# EAGLE design dw-probe-v2.0 (EAGLE 9.5.1)
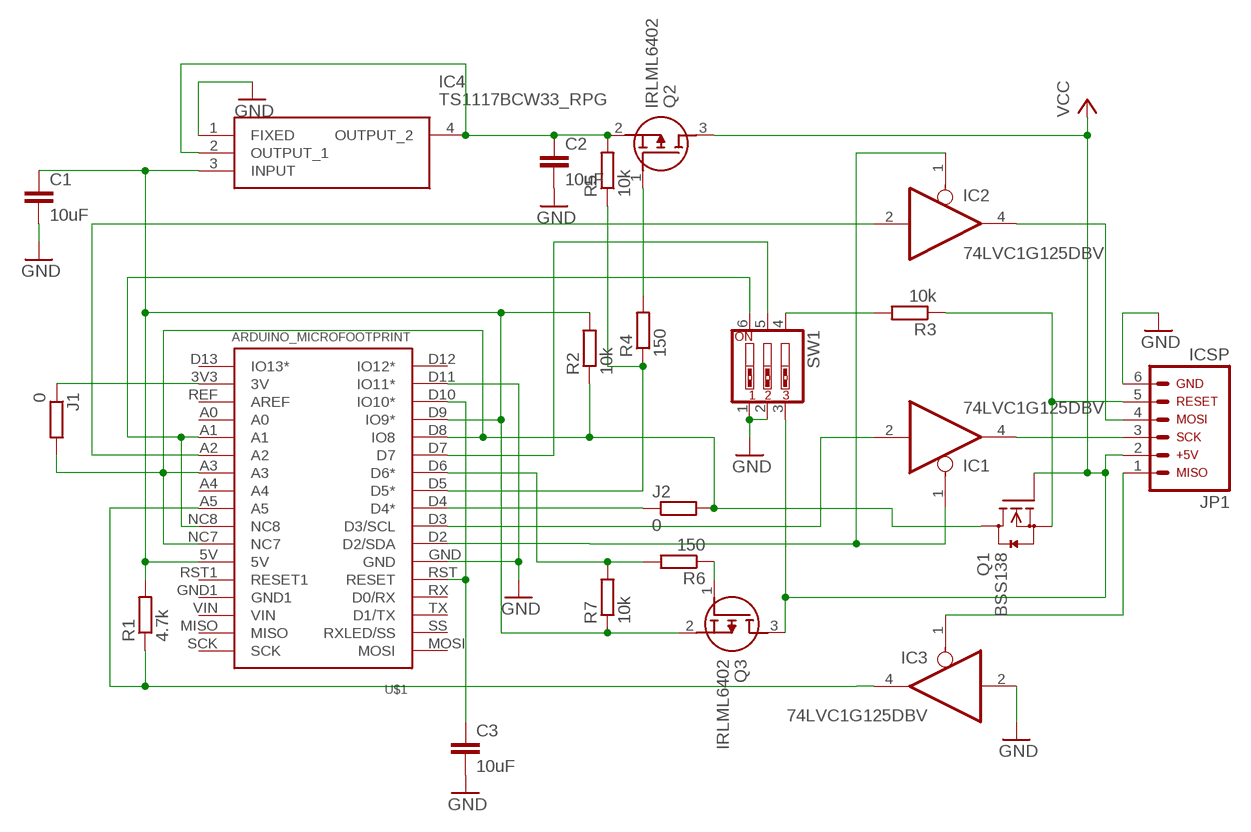
[diagram p0: schematic, sheet 1]

## Parts
C1  10uF  C-EUC0805  [C0805]
C2  10uF  C-EUC0805  [C0805]
C3  10uF  C-EUC0805  [C0805]
IC1  74LVC1G125DBV  [SOT23-5]
IC2  74LVC1G125DBV  [SOT23-5]
IC3  74LVC1G125DBV  [SOT23-5]
IC4  TS1117BCW33_RPG  [SOT230P700X190-4N]
J1  0  R-EU_R0805  [R0805]
J2  0  R-EU_R0805  [R0805]
JP1  ARDUINO_CONN-ICSP  [CONN-2X03]
Q1  BSS138  [SOT23]
Q2  IRLML6402  [SOT95P237X112-3N]
Q3  IRLML6402  [SOT95P237X112-3N]
R1  4.7k  R-EU_R0805  [R0805]
R2  10k  R-EU_R0805  [R0805]
R3  10k  R-EU_R0805  [R0805]
R4  150  R-EU_R0805  [R0805]
R5  10k  R-EU_R0805  [R0805]
R6  150  R-EU_R0805  [R0805]
R7  10k  R-EU_R0805  [R0805]
SW1  SW_DIP-3  [EDG-03]
U$1  ARDUINO_MICROFOOTPRINT  [ARDUINO-MICRO]

## Nets
GND: C1.2 C2.2 C3.2 IC3.2(I) IC4.1(FIXED) JP1.6 SW1.1 SW1.2 U$1.D11(IO11*) U$1.GND
N$1: R3.2 SW1.4
N$2: SW1.6 U$1.A1 U$1.NC8
N$3: IC1.1(OE) IC2.1(OE) U$1.D2(D2/SDA)
N$4: J1.2 J2.2 Q1.3(D) R2.1 U$1.A3 U$1.D8(IO8) U$1.NC7
N$5: C1.1 IC4.3(INPUT) Q3.2(S) R1.2 R2.2 R7.1 U$1.5V U$1.D9(IO9*)
N$6: IC1.2(I) U$1.D3(D3/SCL)
N$7: IC2.2(I) U$1.A2
N$8: IC3.4(O) R1.1 U$1.A5
N$9: C3.1 U$1.D10(IO10*) U$1.RST(RESET)
N$10: IC2.4(O) JP1.4
N$11: SW1.5 U$1.D7
N$12: IC3.1(OE) JP1.1
N$13: J1.1 U$1.3V3(3V)
N$14: JP1.5 Q1.2(S) R3.1
N$15: Q3.1(G) R6.1
N$16: C2.1 IC4.2(OUTPUT_1) IC4.4(OUTPUT_2) Q2.2(S) R5.2
N$17: IC1.4(O) JP1.3
N$18: R4.1 R5.1 U$1.D5(D5*)
N$19: Q2.1(G) R4.2
N$20: R6.2 R7.2 U$1.D6(D6*)
N$23: J2.1 U$1.D4(D4*)
VCC: JP1.2 Q1.1(G) Q2.3(D) Q3.3(D) SW1.3
Unconnected: U$1.A0 U$1.A4 U$1.D12(IO12*) U$1.D13(IO13*) U$1.GND1 U$1.MISO U$1.MOSI U$1.REF(AREF) U$1.RST1(RESET1) U$1.RX(D0/RX) U$1.SCK U$1.SS(RXLED/SS) U$1.TX(D1/TX) U$1.VIN

## Power pins joined to a net without a drawn wire
GND: IC1.3(GND) IC2.3(GND) IC3.3(GND)
VCC: IC1.5(VCC) IC2.5(VCC) IC3.5(VCC)

## Library data of the parts
C1-C3 = rcl:C-EU: CAPACITOR, European symbol; SPICEPREFIX: C
IC1-IC3 = 74xx-little-us:74*1G125: Single Bus Buffer Gate with 3-State Output
IC4 = TS1117BCW33_RPG:TS1117BCW33_RPG: Taiwan Semiconductor TS1117BCW33 RPG, LDO Regulator, 800mA, 3.3 V, +/-2% 4-Pin, SOT-223 Source: Datasheet <http://uk.rs-online.com/web/p/products/1698939>; ARROW_PART_NUMBER: TS1117BCW33 RPG; ARROW_PRICE-STOCK: https://www.arrow.com/en/products/ts1117bcw33rpg/taiwan-semiconductor; DESCRIPTION: Taiwan Semiconductor TS1117BCW33 RPG, LDO Regulator, 800mA, 3.3 V, +/-2% 4-Pin, SOT-223; HEIGHT: 1.9mm; MANUFACTURER_NAME: Taiwan Semiconductor; MANUFACTURER_PART_NUMBER: TS1117BCW33 RPG; MOUSER_PART_NUMBER: 821-TS1117BCW33RPG; MOUSER_PRICE-STOCK: https://www.mouser.co.uk/ProductDetail/Taiwan-Semiconductor/TS1117BCW33-RPG?qs=5aG0NVq1C4zdwcJSPRwZGg%3D%3D
J1 J2 R1-R7 = rcl:R-EU_: RESISTOR, European symbol; SPICEPREFIX: R
JP1 = arduino_jw:ARDUINO_CONN-ICSP: Arduino ICSP I/O Header This is the ICSP I/O header on the Arduino Uno R3. This connector is labeled with the following pin assignments: MISO +5V SCK MOSI RESET GND NOTE: Be sure you install this connector with the correct orientation on your PCB layout. Pin 1 has a square pad to assist with orientation.
Q1 = m-pad-2.1:BSS138: Fairchild Semiconductors BSS138 N-Channel Logic Level Enhancement Mode Field Effect Transistor General Description: These N-Channel enhancement mode field effect transistors are produced using Fairchild's proprietary, high cell density, DMOS technology. These products have been designed to minimize on-state resistance while provide rugged, reliable, and fast switching performance.These products are particularly suited for low voltage, low current applications such as small servo motor control, power MOSFET gate drivers, and other switching applications. Features: 0.22 A, 50 V. RDS(ON) = 3.5Ohm @ VGS = 10 V RDS(ON) = 6.0Ohm @ VGS = 4.5 V High density cell design for extremely low RDS(ON) Rugged and Reliable Compact industry standard SOT-23 surface mount package Please send any comments to: messi@users.sourceforge.net
Q2 Q3 = IRLML6402:IRLML6402: P-Channel MOSFET Transistor, 3.7 A, 20 V, 3-Pin SOT-23 International Rectifier IRLML6402 Source: Datasheet <https://datasheetspdf.com/pdf/513015/InternationalRectifier/IRLML6402/1>; DESCRIPTION: P-Channel MOSFET Transistor, 3.7 A, 20 V, 3-Pin SOT-23 International Rectifier IRLML6402; HEIGHT: 1.12mm; MANUFACTURER_NAME: Infineon; MANUFACTURER_PART_NUMBER: IRLML6402; MOUSER_PART_NUMBER: N/A; MOUSER_PRICE-STOCK: https://www.mouser.co.uk/ProductDetail/Infineon-IR/IRLML6402/?qs=Gkr2N%2F2q3o277qI%252BRzUP%252Bw%3D%3D
SW1 = special:SW_DIP-3: DIP SWITCH
U$1 = arduino-micro:ARDUINO_MICRO

## Board
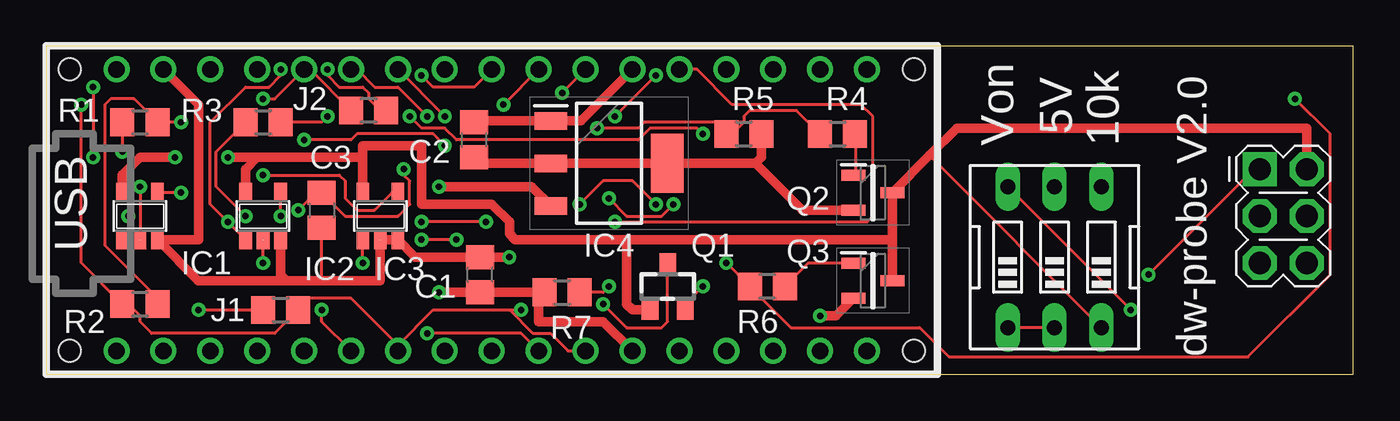
[diagram p1: board, top side]
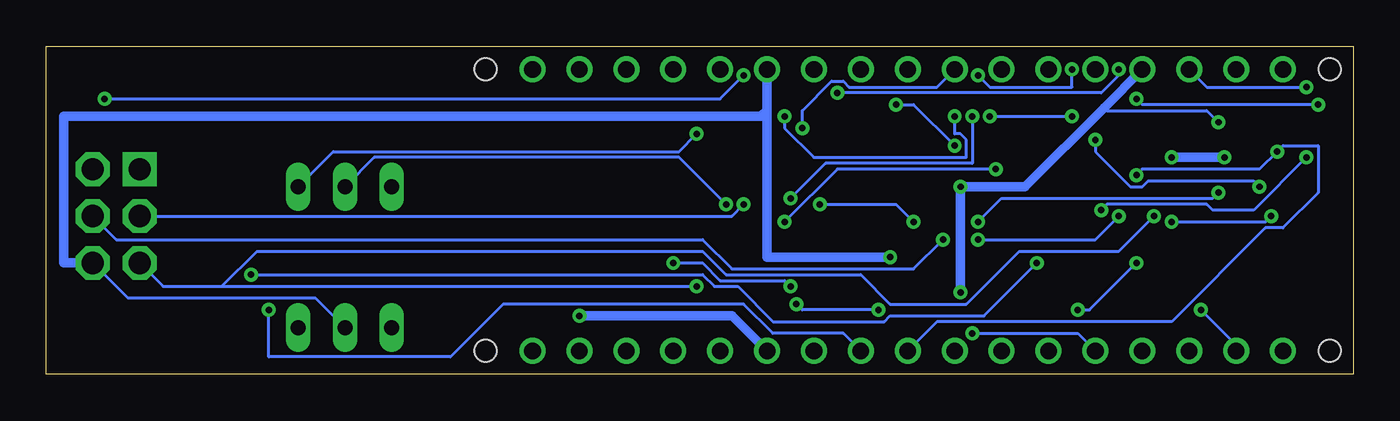
[diagram p2: board, bottom side, seen from below]

Size 70.79 x 17.77 mm. Coordinates in mm from the lower left corner, seen from the top.
Outline: 0,0 70.79,0 70.79,17.77 0,17.77 0,0
Copper layers (1*16): Top 0.035mm / dielectric 1.5mm / Bottom 0.035mm
Design rules "default *": minimum track width 6mil, minimum drill 0.35mm, track to track 6mil, track to pad 6mil, pad to pad 6mil, via to via 6mil, smd to smd 6mil, copper to edge 10mil, drill to drill 6mil, minimum pad ring 10mil, minimum via ring 8mil, stop-mask expansion 4mil, vias tented up to drill 0mil, thermal gap 10mil

### Footprints (pad centres in the part's own frame; a part is rotated, then mirrored left to right if it is on the bottom)
C0805 = smd 1.3 x 1.5: 1 -0.95,0; 2 0.95,0
SOT23-5 = smd 0.69 x 0.99: 1 -0.95,-1.29; 2 0,-1.29; 3 0.95,-1.29; 4 0.95,1.3; 5 -0.95,1.3
SOT230P700X190-4N = smd 1.75 x 0.95: 1 -3.15,2.3; 2 -3.15,0; 3 -3.15,-2.3 | smd 1.75 x 3.2: 4 3.15,0
R0805 = smd 1.3 x 1.5: 1 -0.95,0; 2 0.95,0
CONN-2X03 = drill 1.2 pad 1.829 square: 1 0,0 | drill 1.2 pad 1.829 octagon: 2 2.54,0; 3 0,-2.54; 4 2.54,-2.54; 5 0,-5.08; 6 2.54,-5.08
SOT23 = smd 0.9 x 1.2: 1 -0.95,-1.2; 2 0.95,-1.2; 3 0,1.2
SOT95P237X112-3N = smd 1.3 x 0.6: 1 -1.05,0.95; 2 -1.05,-0.95; 3 1.05,0
EDG-03 = drill 0.813 long: 1 -2.54,-3.81; 2 0,-3.81; 3 2.54,-3.81; 4 2.54,3.81; 5 0,3.81; 6 -2.54,3.81
ARDUINO-MICRO = drill 0.9: 3V3 16.51,3.81; 5V 16.51,29.21; A0 16.51,8.89; A1 16.51,11.43; A2 16.51,13.97; A3 16.51,16.51; A4 16.51,19.05; A5 16.51,21.59; D2 1.27,26.67; D3 1.27,24.13; D4 1.27,21.59; D5 1.27,19.05; D6 1.27,16.51; D7 1.27,13.97; D8 1.27,11.43; D9 1.27,8.89; D10 1.27,6.35; D11 1.27,3.81; D12 1.27,1.27; D13 16.51,1.27; GND 1.27,29.21; GND1 16.51,34.29; MISO 16.51,39.37; MOSI 1.27,41.91; NC7 16.51,26.67; NC8 16.51,24.13; REF 16.51,6.35; RST 1.27,31.75; RST1 16.51,31.75; RX 1.27,34.29; SCK 16.51,41.91; SS 1.27,39.37; TX 1.27,36.83; VIN 16.51,36.83 | hole 1.2: 1.27,-1.27; 16.51,-1.27; 1.27,44.45; 16.51,44.45

### Placement (x,y rotation side)
C1  23.5,5.4 90 top
C2  23.18,12.7 90 top
C3  14.92,8.89 270 top
IC1  5.08,8.57 0 top
IC2  11.75,8.57 0 top
IC3  18.1,8.57 0 top
IC4  30.48,11.43 0 top
J1  12.7,3.49 0 top
J2  17.46,14.29 180 top
JP1  65.72,11.11 0 top
Q1  33.66,4.76 0 top
Q2  44.77,9.84 0 top
Q3  44.77,5.08 0 top
R1  5.08,13.65 0 top
R2  5.08,3.81 0 top
R3  11.75,13.65 0 top
R4  42.86,13.02 0 top
R5  37.78,13.02 0 top
R6  39.05,4.76 180 top
R7  27.94,4.45 0 top
SW1  54.61,6.35 0 top
U$1  2.54,17.78 270 top

### Tracks (layer width: path | path; a pad name or v marks a point on that pad's centre or on a via)
GND  (via drill 0.35)
  Top 0.152: 14.92,5.08 C3.2 | SW1.2 SW1.1
  Top 0.508: U$1.GND 28.97,13.73 IC4.1 23.26,13.73 C2.2 | 21.27,6.35 C1.2 | C1.2 19.98,6.35 IC3.3 IC3.2 18.1,5.08 14.92,5.08 13.02,5.08 | 13.02,5.08 12.7,5.4 IC2.3 | 13.02,5.08 8.23,5.08 IC1.3 8.23,7.28 8.26,7.3 8.26,14.61 U$1.D11 | C1.2 v25.08,6.35
  Bottom 0.152: JP1.6 66.36,4.13 56.2,4.13 SW1.2
  Bottom 0.508: U$1.GND 31.75,14.29 | 31.75,14.29 32.07,13.97 69.85,13.97 69.85,6.03 JP1.6 | v25.08,6.35 31.75,6.35 31.75,14.29
N$1  (via drill 0.35)
  Top 0.152: v15.24,13.97 14.92,13.65 R3.2 | v19.68,13.97 20.32,13.34 21.59,13.34 22.23,12.7 32.07,12.7 32.7,13.34 35.24,13.34 v35.56,13.02
  Bottom 0.152: v19.68,13.97 v15.24,13.97 | v35.56,13.02 36.51,12.06 55.24,12.06 SW1.4
N$2  (via drill 0.35)
  Top 0.152: v58.74,3.49 SW1.6 | v20.64,2.22 25.72,2.22 U$1.NC8
  Bottom 0.152: v58.74,3.49 58.74,0.95 48.9,0.95 46.04,3.81 33.02,3.81 31.43,2.22 27.62,2.22 U$1.NC8 | U$1.A1 14.92,2.22 v20.64,2.22
N$3  (via drill 0.35)
  Top 0.152: v4.45,8.57 4.45,7.3 IC1.1 | IC2.1 10.79,7.3 v9.84,8.26 8.89,9.21 8.89,13.65 10.79,15.56 12.06,15.56 12.7,16.19 v12.7,16.51 | v27.94,15.24 U$1.D2
  Bottom 0.152: v4.45,8.57 4.76,8.26 v9.84,8.26 | v27.94,15.24 13.65,15.24 12.7,16.19 v12.7,16.51
N$4  (via drill 0.35)
  Top 0.152: J2.2 14.29,16.51 U$1.D8 12.38,14.92 v11.75,14.92 | v30.16,3.81 31.43,2.54 33.34,2.54 33.66,2.86 33.66,5.71 Q1.3 | 25.08,3.49 20.95,3.49 19.05,1.59 | 25.08,3.49 v25.72,3.49 | 19.05,1.59 U$1.A3 19.05,1.59 | J1.2 14.29,4.13 16.51,4.13 19.05,1.59 | J1.2 | J1.2 12.38,2.22 5.71,2.22 5.08,2.86 5.08,3.17 4.45,3.81 R2.1 1.91,6.03 v1.91,14.61 | U$1.NC7 28.26,1.27 27.3,2.22 26.35,2.22 25.08,3.49
  Bottom 0.152: v30.16,3.81 29.84,3.49 v25.72,3.49 | v11.75,14.92 11.43,14.61 v1.91,14.61
N$5  (via drill 0.35)
  Top 0.152: R1.2 4.76,14.92 3.49,14.92 3.17,14.61 3.17,6.99 5.71,4.45 5.71,3.81 R2.2 | R1.2 | v7.3,13.65 R1.2
  Top 0.508: U$1.5V 30.16,2.86 26.67,2.86 26.67,4.12 R7.1 C1.1 | C1.1 | IC4.3 26.3,10.16 v21.27,10.16 | v21.27,4.45 C1.1 | Q3.2 42.76,3.17 v41.91,3.17
  Bottom 0.152: v7.3,13.65 7.94,14.29 13.34,14.29 13.49,14.45
  Bottom 0.508: v21.27,4.45 v21.27,10.16 17.78,10.16 13.49,14.45 U$1.D9 | U$1.5V 33.66,3.17 v41.91,3.17
N$6  (via drill 0.35)
  Top 0.152: v5.08,10.16 5.08,7.3 IC1.2 | v13.97,12.7 16.51,12.7 16.83,13.02 20.95,13.02 v21.59,12.38 | U$1.D3 v24.77,14.61
  Bottom 0.152: v5.08,10.16 5.4,10.48 11.11,10.48 11.43,10.16 12.06,10.16 13.97,12.06 v13.97,12.7 | v21.59,12.38 23.81,14.61 v24.77,14.61
N$7  (via drill 0.35)
  Top 0.152: v11.75,6.03 11.75,6.99 IC2.2 | v14.92,3.49 14.92,2.86 U$1.A2
  Bottom 0.152: v11.75,6.03 14.29,3.49 v14.92,3.49
N$8  (via drill 0.35)
  Top 0.152: v11.75,10.79 15.88,10.79 16.19,10.48 16.19,9.53 16.83,8.89 17.78,8.89 18.73,9.84 IC3.4 | v4.13,12.06 R1.1
  Bottom 0.152: v11.75,10.79 11.43,11.11 5.08,11.11 v4.13,12.06 3.81,12.38 1.91,12.38 1.91,9.84 3.81,7.94 4.76,7.94 9.84,2.86 22.54,2.86 U$1.A5
N$9  (via drill 0.35)
  Top 0.152: v13.65,8.89 14.29,9.53 14.92,9.53 C3.1 16.19,8.57 19.05,8.57 19.68,9.21 19.68,10.48 19.37,10.79 v19.37,11.11 | v2.54,15.56 v2.54,11.75 | U$1.RST 35.24,16.51 37.15,14.61 44.13,14.61 44.77,13.97 44.77,8.57 44.45,8.26 v30.8,8.26
  Bottom 0.152: v13.65,8.89 13.34,9.21 7.94,9.21 7.62,8.89 5.4,8.89 v2.54,11.75 | v2.54,15.56 7.94,15.56 U$1.D10 | v30.8,8.26 27.94,11.11 v19.37,11.11
N$10  (via drill 0.35)
  Top 0.152: v12.7,8.57 12.7,9.84 IC2.4 | v22.23,7.3 v20.32,7.3
  Bottom 0.152: v12.7,8.57 13.97,7.3 v20.32,7.3 | v22.23,7.3 23.81,5.71 33.66,5.71 35.24,7.3 66.99,7.3 JP1.4
N$11  (via drill 0.35)
  Top 0.152: v33.97,9.21 33.34,8.57 31.43,8.57 v30.48,9.53 | v20.64,13.97 19.05,15.56 17.78,15.56 16.83,16.51 U$1.D7
  Bottom 0.152: SW1.5 53.02,11.75 36.51,11.75 v33.97,9.21 | v30.48,9.53 28.57,11.43 20.64,11.43 v20.64,13.97
N$12  (via drill 0.35)
  Top 0.152: v17.14,6.03 17.14,6.99 IC3.1 | v59.69,5.4 65.41,11.11 JP1.1
  Bottom 0.152: v17.14,6.03 20,3.17 25.08,3.17 25.4,2.86 31.43,2.86 33.34,4.76 34.61,4.76 35.24,5.4 v59.69,5.4
N$13  (via drill 0.35)
  Top 0.152: v8.26,3.49 J1.1
  Bottom 0.152: v8.26,3.49 6.35,1.59 U$1.3V3
N$14  (via drill 0.35)
  Top 0.152: v35.56,4.76 34.61,3.81 Q1.2 | v10.79,8.57 9.21,10.16 9.21,12.06 R3.1
  Bottom 0.152: 61.28,4.76 64.45,4.76 JP1.5 | 61.28,4.76 v35.56,4.76 | v10.79,8.57 12.7,6.67 18.1,6.67 20.95,3.81 25.08,3.81 26.67,5.4 33.97,5.4 35.24,6.67 59.37,6.67 61.28,4.76
N$15
  Top 0.152: Q3.1 43.5,6.03 41.27,6.03 R6.1
N$16
  Top 0.508: C2.1 23.5,11.43 IC4.2 IC4.4 38.42,11.43 | 38.42,11.43 38.73,11.74 R5.2 | Q2.2 40.95,8.89 38.42,11.43
N$17  (via drill 0.35)
  Top 0.152: v7.3,9.84 6.03,9.84 IC1.4 | v23.81,8.26 v20.32,8.26 | v28.89,9.21 30.16,10.48 31.75,10.48 v33.02,9.21
  Bottom 0.152: v7.3,9.84 7.62,9.53 19.05,9.53 v20.32,8.26 | v23.81,8.26 24.77,9.21 v28.89,9.21 | v33.02,9.21 33.66,8.57 JP1.3
N$18  (via drill 0.35)
  Top 0.152: 37.78,13.65 37.15,13.02 R5.1 | 37.78,13.65 37.78,13.97 38.1,14.29 40.64,14.29 R4.1 | v29.84,13.34 32.07,13.34 32.38,13.65 37.78,13.65
  Bottom 0.152: U$1.D5 22.54,15.56 27.3,15.56 27.62,15.88 28.26,15.88 29.84,14.29 v29.84,13.34
N$19
  Top 0.152: Q2.1 43.81,10.79 R4.2
N$20  (via drill 0.35)
  Top 0.152: v30.48,4.76 30.16,4.45 R7.2 | R6.2 v36.83,6.03 | R6.2 | v21.59,13.97 U$1.D6 | v33.02,16.19 v30.8,13.97 | v67.63,14.92 69.53,13.02 69.53,5.4 65.09,0.95 48.9,0.95 47.31,2.54 40.32,2.54 R6.2
  Bottom 0.152: v30.48,4.76 30.8,5.08 34.29,5.08 35.24,6.03 v36.83,6.03 | v21.59,13.97 21.59,13.02 21.27,13.02 20.95,12.7 20.95,11.75 29.21,11.75 30.8,13.34 v30.8,13.97 | v33.02,16.19 34.29,14.92 v67.63,14.92
N$23  (via drill 0.35)
  Top 0.152: v15.24,16.51 15.24,16.19 15.88,15.56 17.14,15.56 17.46,15.24 17.46,14.92 18.1,14.29 J2.1 | v20.32,16.19 20.95,15.56 23.18,15.56 U$1.D4
  Bottom 0.152: v15.24,16.51 15.24,15.56 19.68,15.56 v20.32,16.19
VCC  (via drill 0.35)
  Top 0.152: SW1.3 47.94,11.75 47.83,11.86
  Top 0.508: JP1.2 68.26,13.34 49.31,13.34 47.83,11.86 Q2.3 45.82,7.3 | 45.82,7.3 Q3.3 | Q1.1 32.63,3.49 31.75,3.49 31.43,3.81 31.43,7.3 | 31.43,7.3 45.82,7.3 | 31.43,7.3 25.4,7.3 25.08,7.62 25.08,8.26 24.13,9.21 20.32,9.21 20.32,12.38 17.14,12.38 17.14,11.75 | 17.14,11.75 IC3.5 | IC2.5 10.8,11.11 10.79,11.11 11.43,11.75 | 17.14,11.75 11.43,11.75 | 11.43,11.75 v9.84,11.75 | v6.99,11.75 5.08,11.75 4.13,10.8 IC1.5
  Bottom 0.508: v9.84,11.75 v6.99,11.75

### Text on the board
tNames: 5V | Von | 10k | USB | dw-probe V2.0